# EasyEDA Pro project Nibunkatsu_One_Rev1_Project.epro, schematic Schematic1
Board Name: Board1; Create Date: 2025-12-03; Page Name: P1; Project Name: Nibunkatsu One; Schematic Name: Schematic1; Update Date: 2025-12-07; Company: GabiBrawl; Page Size: A4; Version: V1.0
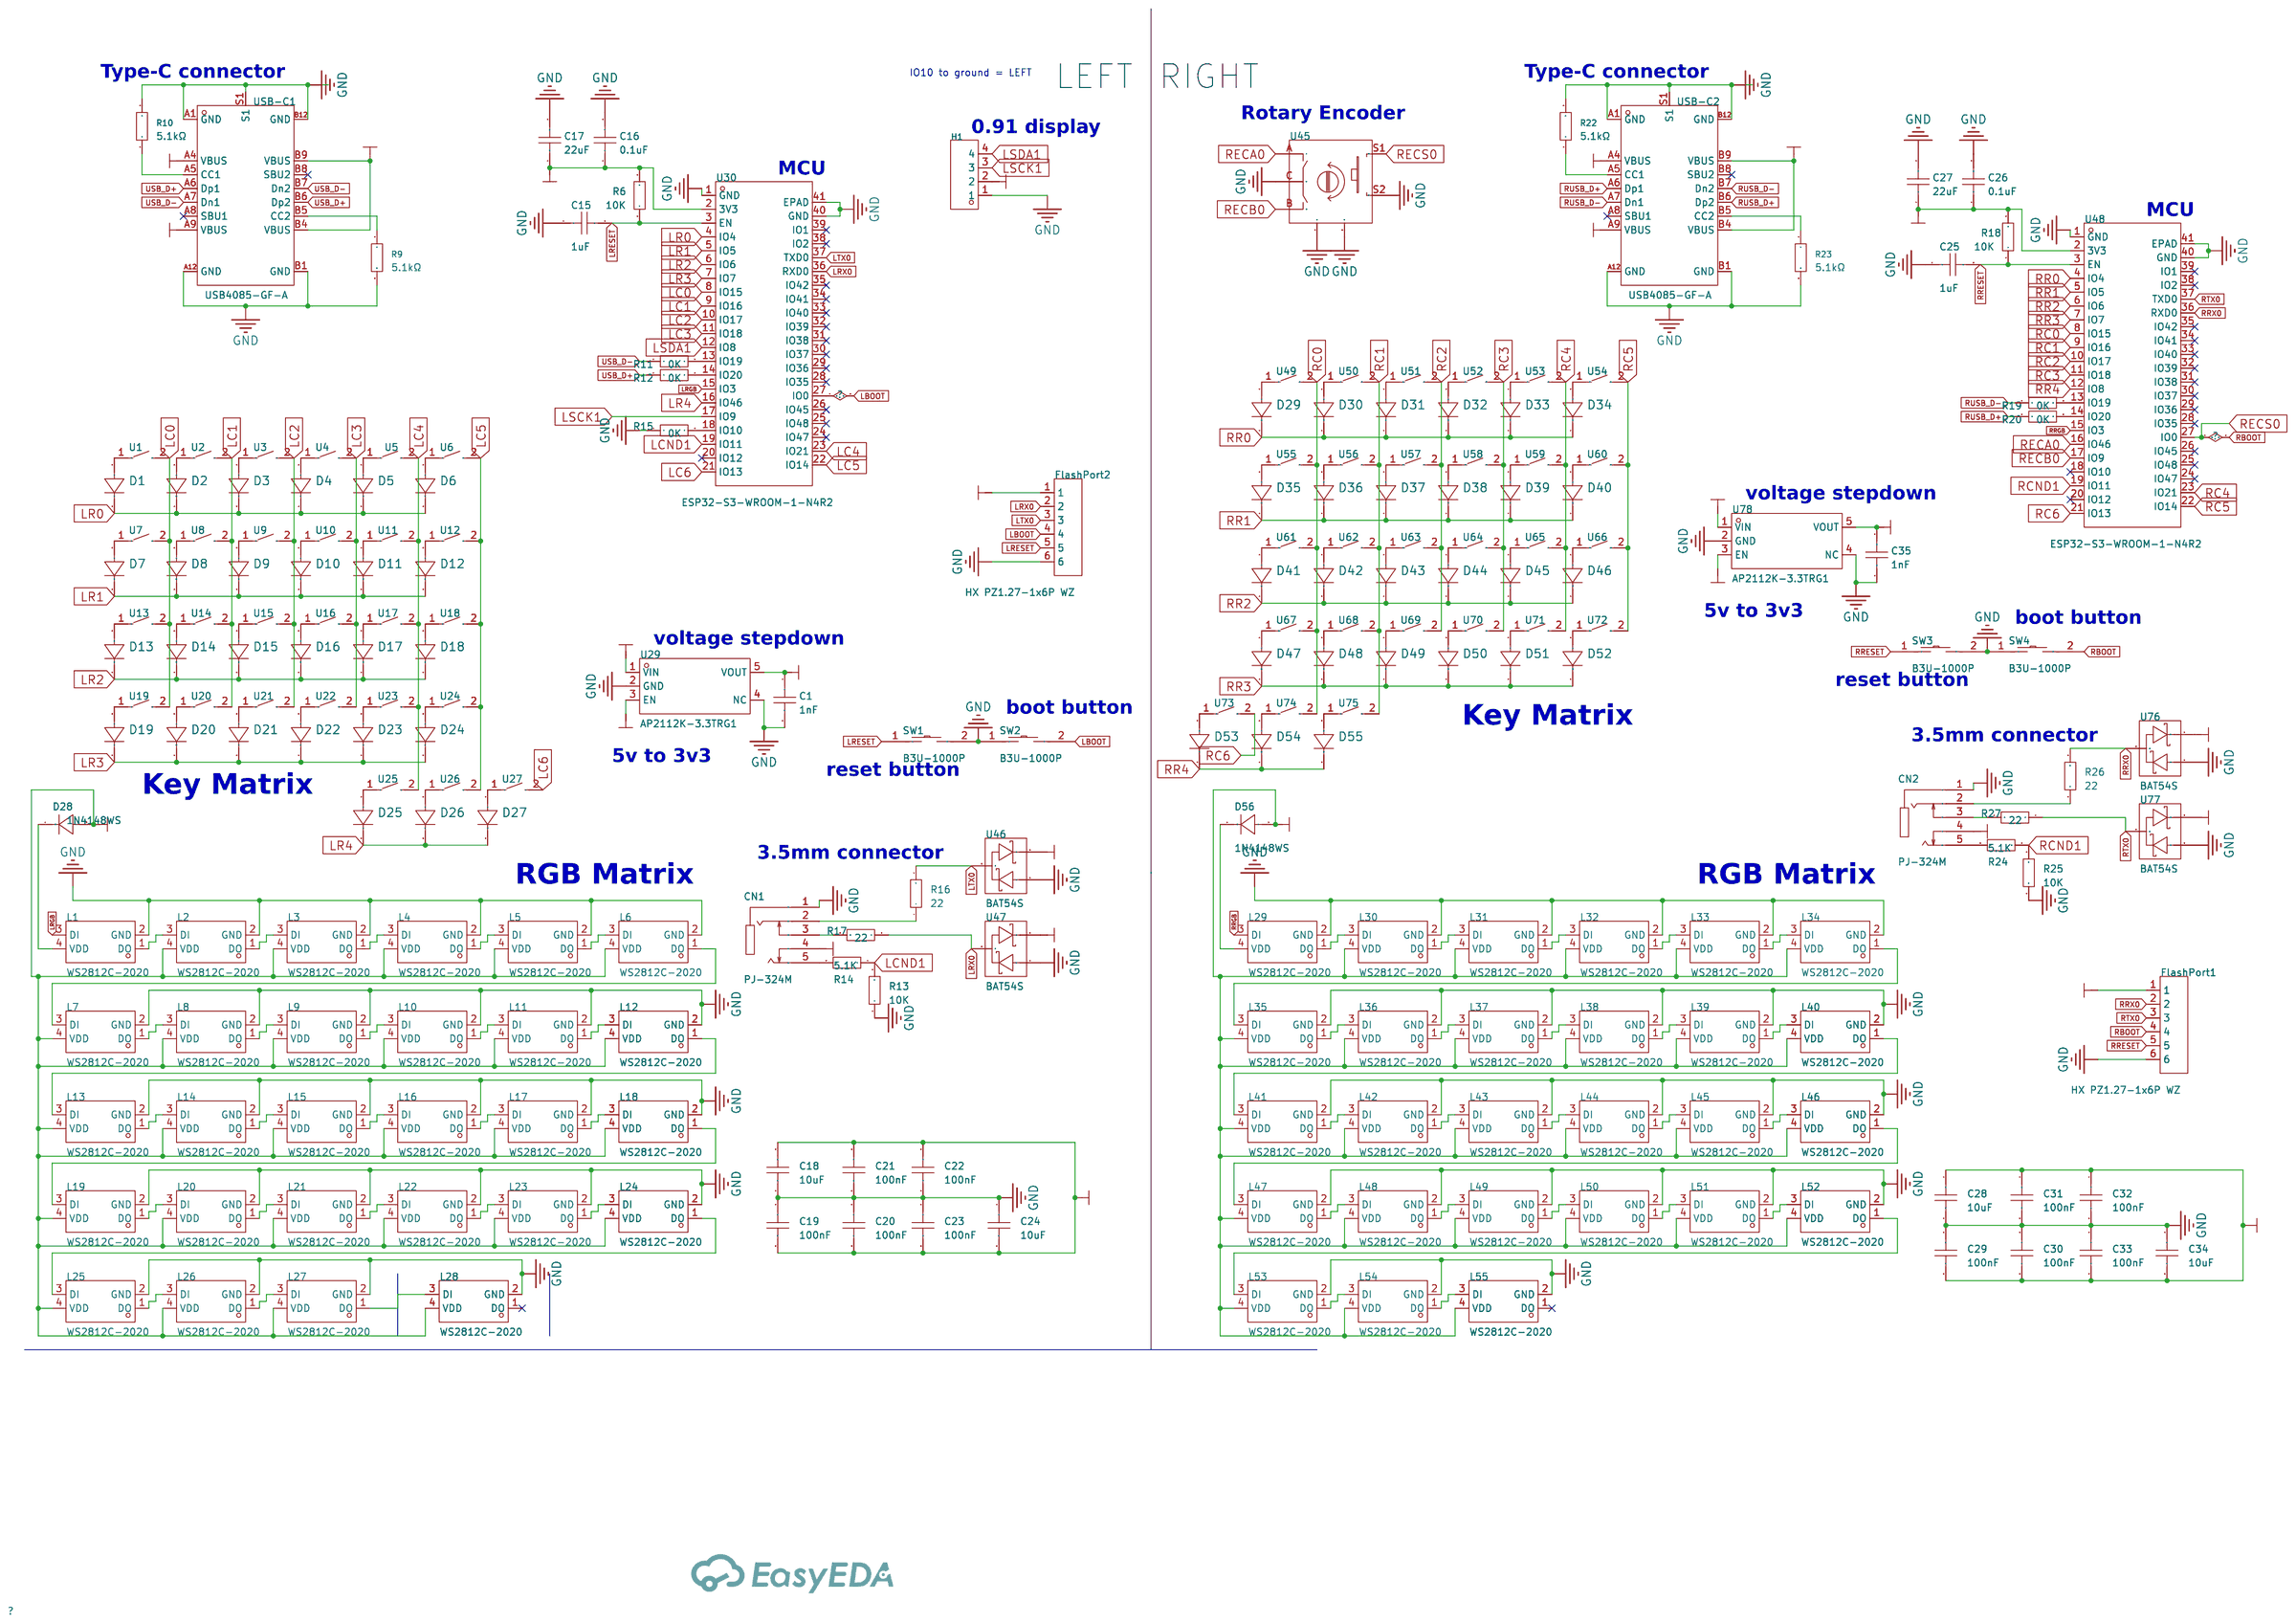
[diagram p0: schematic sheet]

## Parts
C1  1nF  [C0603]
C15  1uF  [C0603]
C16  0.1uF  [C0603]
C17  22uF  [C0603]
C18  10uF  [C0603]
C19  100nF  [C0603]
C20  100nF  [C0603]
C21  100nF  [C0603]
C22  100nF  [C0603]
C23  100nF  [C0603]
C24  10uF  [C0603]
C25  1uF  [C0603]
C26  0.1uF  [C0603]
C27  22uF  [C0603]
C28  10uF  [C0603]
C29  100nF  [C0603]
C30  100nF  [C0603]
C31  100nF  [C0603]
C32  100nF  [C0603]
C33  100nF  [C0603]
C34  10uF  [C0603]
C35  1nF  [C0603]
CN1  PJ-324M  [AUDIO-TH_PJ-324M]
CN2  PJ-324M  [AUDIO-TH_PJ-324M]
D1  1N4148WS  [SOD-323_L1.7-W1.3-LS2.7-RD]
D2  1N4148WS  [SOD-323_L1.7-W1.3-LS2.7-RD]
D3  1N4148WS  [SOD-323_L1.7-W1.3-LS2.7-RD]
D4  1N4148WS  [SOD-323_L1.7-W1.3-LS2.7-RD]
D5  1N4148WS  [SOD-323_L1.7-W1.3-LS2.7-RD]
D6  1N4148WS  [SOD-323_L1.7-W1.3-LS2.7-RD]
D7  1N4148WS  [SOD-323_L1.7-W1.3-LS2.7-RD]
D8  1N4148WS  [SOD-323_L1.7-W1.3-LS2.7-RD]
D9  1N4148WS  [SOD-323_L1.7-W1.3-LS2.7-RD]
D10  1N4148WS  [SOD-323_L1.7-W1.3-LS2.7-RD]
D11  1N4148WS  [SOD-323_L1.7-W1.3-LS2.7-RD]
D12  1N4148WS  [SOD-323_L1.7-W1.3-LS2.7-RD]
D13  1N4148WS  [SOD-323_L1.7-W1.3-LS2.7-RD]
D14  1N4148WS  [SOD-323_L1.7-W1.3-LS2.7-RD]
D15  1N4148WS  [SOD-323_L1.7-W1.3-LS2.7-RD]
D16  1N4148WS  [SOD-323_L1.7-W1.3-LS2.7-RD]
D17  1N4148WS  [SOD-323_L1.7-W1.3-LS2.7-RD]
D18  1N4148WS  [SOD-323_L1.7-W1.3-LS2.7-RD]
D19  1N4148WS  [SOD-323_L1.7-W1.3-LS2.7-RD]
D20  1N4148WS  [SOD-323_L1.7-W1.3-LS2.7-RD]
D21  1N4148WS  [SOD-323_L1.7-W1.3-LS2.7-RD]
D22  1N4148WS  [SOD-323_L1.7-W1.3-LS2.7-RD]
D23  1N4148WS  [SOD-323_L1.7-W1.3-LS2.7-RD]
D24  1N4148WS  [SOD-323_L1.7-W1.3-LS2.7-RD]
D25  1N4148WS  [SOD-323_L1.7-W1.3-LS2.7-RD]
D26  1N4148WS  [SOD-323_L1.7-W1.3-LS2.7-RD]
D27  1N4148WS  [SOD-323_L1.7-W1.3-LS2.7-RD]
D28  1N4148WS  [SOD-323_L1.7-W1.3-LS2.7-RD]
D29  1N4148WS  [SOD-323_L1.7-W1.3-LS2.7-RD]
D30  1N4148WS  [SOD-323_L1.7-W1.3-LS2.7-RD]
D31  1N4148WS  [SOD-323_L1.7-W1.3-LS2.7-RD]
D32  1N4148WS  [SOD-323_L1.7-W1.3-LS2.7-RD]
D33  1N4148WS  [SOD-323_L1.7-W1.3-LS2.7-RD]
D34  1N4148WS  [SOD-323_L1.7-W1.3-LS2.7-RD]
D35  1N4148WS  [SOD-323_L1.7-W1.3-LS2.7-RD]
D36  1N4148WS  [SOD-323_L1.7-W1.3-LS2.7-RD]
D37  1N4148WS  [SOD-323_L1.7-W1.3-LS2.7-RD]
D38  1N4148WS  [SOD-323_L1.7-W1.3-LS2.7-RD]
D39  1N4148WS  [SOD-323_L1.7-W1.3-LS2.7-RD]
D40  1N4148WS  [SOD-323_L1.7-W1.3-LS2.7-RD]
D41  1N4148WS  [SOD-323_L1.7-W1.3-LS2.7-RD]
D42  1N4148WS  [SOD-323_L1.7-W1.3-LS2.7-RD]
D43  1N4148WS  [SOD-323_L1.7-W1.3-LS2.7-RD]
D44  1N4148WS  [SOD-323_L1.7-W1.3-LS2.7-RD]
D45  1N4148WS  [SOD-323_L1.7-W1.3-LS2.7-RD]
D46  1N4148WS  [SOD-323_L1.7-W1.3-LS2.7-RD]
D47  1N4148WS  [SOD-323_L1.7-W1.3-LS2.7-RD]
D48  1N4148WS  [SOD-323_L1.7-W1.3-LS2.7-RD]
D49  1N4148WS  [SOD-323_L1.7-W1.3-LS2.7-RD]
D50  1N4148WS  [SOD-323_L1.7-W1.3-LS2.7-RD]
D51  1N4148WS  [SOD-323_L1.7-W1.3-LS2.7-RD]
D52  1N4148WS  [SOD-323_L1.7-W1.3-LS2.7-RD]
D53  1N4148WS  [SOD-323_L1.7-W1.3-LS2.7-RD]
D54  1N4148WS  [SOD-323_L1.7-W1.3-LS2.7-RD]
D55  1N4148WS  [SOD-323_L1.7-W1.3-LS2.7-RD]
D56  1N4148WS  [SOD-323_L1.7-W1.3-LS2.7-RD]
FlashPort1  HX PZ1.27-1x6P WZ  [HDR-TH_6P_HXPZ1.27-1X6PWZ]
FlashPort2  HX PZ1.27-1x6P WZ  [HDR-TH_6P_HXPZ1.27-1X6PWZ]
H1  2.54-1*4P母  [HDR-TH_4P-P2.54-V-F]
L1  WS2812C-2020  [LED-SMD_L2.2-W2.0]
L2  WS2812C-2020  [LED-SMD_L2.2-W2.0]
L3  WS2812C-2020  [LED-SMD_L2.2-W2.0]
L4  WS2812C-2020  [LED-SMD_L2.2-W2.0]
L5  WS2812C-2020  [LED-SMD_L2.2-W2.0]
L6  WS2812C-2020  [LED-SMD_L2.2-W2.0]
L7  WS2812C-2020  [LED-SMD_L2.2-W2.0]
L8  WS2812C-2020  [LED-SMD_L2.2-W2.0]
L9  WS2812C-2020  [LED-SMD_L2.2-W2.0]
L10  WS2812C-2020  [LED-SMD_L2.2-W2.0]
L11  WS2812C-2020  [LED-SMD_L2.2-W2.0]
L12  WS2812C-2020  [LED-SMD_L2.2-W2.0]
L13  WS2812C-2020  [LED-SMD_L2.2-W2.0]
L14  WS2812C-2020  [LED-SMD_L2.2-W2.0]
L15  WS2812C-2020  [LED-SMD_L2.2-W2.0]
L16  WS2812C-2020  [LED-SMD_L2.2-W2.0]
L17  WS2812C-2020  [LED-SMD_L2.2-W2.0]
L18  WS2812C-2020  [LED-SMD_L2.2-W2.0]
L19  WS2812C-2020  [LED-SMD_L2.2-W2.0]
L20  WS2812C-2020  [LED-SMD_L2.2-W2.0]
L21  WS2812C-2020  [LED-SMD_L2.2-W2.0]
L22  WS2812C-2020  [LED-SMD_L2.2-W2.0]
L23  WS2812C-2020  [LED-SMD_L2.2-W2.0]
L24  WS2812C-2020  [LED-SMD_L2.2-W2.0]
L25  WS2812C-2020  [LED-SMD_L2.2-W2.0]
L26  WS2812C-2020  [LED-SMD_L2.2-W2.0]
L27  WS2812C-2020  [LED-SMD_L2.2-W2.0]
L28  WS2812C-2020  [LED-SMD_L2.2-W2.0]
L29  WS2812C-2020  [LED-SMD_L2.2-W2.0]
L30  WS2812C-2020  [LED-SMD_L2.2-W2.0]
L31  WS2812C-2020  [LED-SMD_L2.2-W2.0]
L32  WS2812C-2020  [LED-SMD_L2.2-W2.0]
L33  WS2812C-2020  [LED-SMD_L2.2-W2.0]
L34  WS2812C-2020  [LED-SMD_L2.2-W2.0]
L35  WS2812C-2020  [LED-SMD_L2.2-W2.0]
L36  WS2812C-2020  [LED-SMD_L2.2-W2.0]
L37  WS2812C-2020  [LED-SMD_L2.2-W2.0]
L38  WS2812C-2020  [LED-SMD_L2.2-W2.0]
L39  WS2812C-2020  [LED-SMD_L2.2-W2.0]
L40  WS2812C-2020  [LED-SMD_L2.2-W2.0]
L41  WS2812C-2020  [LED-SMD_L2.2-W2.0]
L42  WS2812C-2020  [LED-SMD_L2.2-W2.0]
L43  WS2812C-2020  [LED-SMD_L2.2-W2.0]
L44  WS2812C-2020  [LED-SMD_L2.2-W2.0]
L45  WS2812C-2020  [LED-SMD_L2.2-W2.0]
L46  WS2812C-2020  [LED-SMD_L2.2-W2.0]
L47  WS2812C-2020  [LED-SMD_L2.2-W2.0]
L48  WS2812C-2020  [LED-SMD_L2.2-W2.0]
L49  WS2812C-2020  [LED-SMD_L2.2-W2.0]
L50  WS2812C-2020  [LED-SMD_L2.2-W2.0]
L51  WS2812C-2020  [LED-SMD_L2.2-W2.0]
L52  WS2812C-2020  [LED-SMD_L2.2-W2.0]
L53  WS2812C-2020  [LED-SMD_L2.2-W2.0]
L54  WS2812C-2020  [LED-SMD_L2.2-W2.0]
L55  WS2812C-2020  [LED-SMD_L2.2-W2.0]
R6  10K  [R0603]
R9  5.1kΩ  [R0805]
R10  5.1kΩ  [R0805]
R11  0K  [R0603]
R12  0K  [R0603]
R13  10K  [R0603]
R14  5.1K  [R0603]
R15  0K  [R0603]
R16  22  [R0603]
R17  22  [R0603]
R18  10K  [R0603]
R19  0K  [R0603]
R20  0K  [R0603]
R22  5.1kΩ  [R0805]
R23  5.1kΩ  [R0805]
R24  5.1K  [R0603]
R25  10K  [R0603]
R26  22  [R0603]
R27  22  [R0603]
SW1  B3U-1000P  [KEY-SMD_B3U-1000PM]
SW2  B3U-1000P  [KEY-SMD_B3U-1000PM]
SW3  B3U-1000P  [KEY-SMD_B3U-1000PM]
SW4  B3U-1000P  [KEY-SMD_B3U-1000PM]
U1  -  [SW_Gateron_LowProfile_HotSwap_PTH1]
U2  -  [SW_Gateron_LowProfile_HotSwap_PTH1]
U3  -  [SW_Gateron_LowProfile_HotSwap_PTH1]
U4  -  [SW_Gateron_LowProfile_HotSwap_PTH1]
U5  -  [SW_Gateron_LowProfile_HotSwap_PTH1]
U6  -  [SW_Gateron_LowProfile_HotSwap_PTH1]
U7  -  [SW_Gateron_LowProfile_HotSwap_PTH1]
U8  -  [SW_Gateron_LowProfile_HotSwap_PTH1]
U9  -  [SW_Gateron_LowProfile_HotSwap_PTH1]
U10  -  [SW_Gateron_LowProfile_HotSwap_PTH1]
U11  -  [SW_Gateron_LowProfile_HotSwap_PTH1]
U12  -  [SW_Gateron_LowProfile_HotSwap_PTH1]
U13  -  [SW_Gateron_LowProfile_HotSwap_PTH1]
U14  -  [SW_Gateron_LowProfile_HotSwap_PTH1]
U15  -  [SW_Gateron_LowProfile_HotSwap_PTH1]
U16  -  [SW_Gateron_LowProfile_HotSwap_PTH1]
U17  -  [SW_Gateron_LowProfile_HotSwap_PTH1]
U18  -  [SW_Gateron_LowProfile_HotSwap_PTH1]
U19  -  [SW_Gateron_LowProfile_HotSwap_PTH1]
U20  -  [SW_Gateron_LowProfile_HotSwap_PTH1]
U21  -  [SW_Gateron_LowProfile_HotSwap_PTH1]
U22  -  [SW_Gateron_LowProfile_HotSwap_PTH1]
U23  -  [SW_Gateron_LowProfile_HotSwap_PTH1]
U24  -  [SW_Gateron_LowProfile_HotSwap_PTH1]
U25  -  [SW_Gateron_LowProfile_HotSwap_PTH1]
U26  -  [SW_Gateron_LowProfile_HotSwap_PTH1]
U27  -  [SW_Gateron_LowProfile_HotSwap_PTH1]
U29  AP2112K-3.3TRG1  [SOT-25-5_L2.9-W1.6-P0.95-LS2.8-BL]
U30  ESP32-S3-WROOM-1-N4R2  [WIRELM-SMD_ESP32-S3-WROOM-1]
U45  -  [RotaryEncoder_Alps_EC11E-Switch_Vertical_H20mm]
U46  BAT54S  [SOT-23-3_L2.9-W1.3-P1.90-LS2.4-BR]
U47  BAT54S  [SOT-23-3_L2.9-W1.3-P1.90-LS2.4-BR]
U48  ESP32-S3-WROOM-1-N4R2  [WIRELM-SMD_ESP32-S3-WROOM-1]
U49  -  [SW_Gateron_LowProfile_HotSwap_PTH1]
U50  -  [SW_Gateron_LowProfile_HotSwap_PTH1]
U51  -  [SW_Gateron_LowProfile_HotSwap_PTH1]
U52  -  [SW_Gateron_LowProfile_HotSwap_PTH1]
U53  -  [SW_Gateron_LowProfile_HotSwap_PTH1]
U54  -  [SW_Gateron_LowProfile_HotSwap_PTH1]
U55  -  [SW_Gateron_LowProfile_HotSwap_PTH1]
U56  -  [SW_Gateron_LowProfile_HotSwap_PTH1]
U57  -  [SW_Gateron_LowProfile_HotSwap_PTH1]
U58  -  [SW_Gateron_LowProfile_HotSwap_PTH1]
U59  -  [SW_Gateron_LowProfile_HotSwap_PTH1]
U60  -  [SW_Gateron_LowProfile_HotSwap_PTH1]
U61  -  [SW_Gateron_LowProfile_HotSwap_PTH1]
U62  -  [SW_Gateron_LowProfile_HotSwap_PTH1]
U63  -  [SW_Gateron_LowProfile_HotSwap_PTH1]
U64  -  [SW_Gateron_LowProfile_HotSwap_PTH1]
U65  -  [SW_Gateron_LowProfile_HotSwap_PTH1]
U66  -  [SW_Gateron_LowProfile_HotSwap_PTH1]
U67  -  [SW_Gateron_LowProfile_HotSwap_PTH1]
U68  -  [SW_Gateron_LowProfile_HotSwap_PTH1]
U69  -  [SW_Gateron_LowProfile_HotSwap_PTH1]
U70  -  [SW_Gateron_LowProfile_HotSwap_PTH1]
U71  -  [SW_Gateron_LowProfile_HotSwap_PTH1]
U72  -  [SW_Gateron_LowProfile_HotSwap_PTH1]
U73  -  [SW_Gateron_LowProfile_HotSwap_PTH1]
U74  -  [SW_Gateron_LowProfile_HotSwap_PTH1]
U75  -  [SW_Gateron_LowProfile_HotSwap_PTH1]
U76  BAT54S  [SOT-23-3_L2.9-W1.3-P1.90-LS2.4-BR]
U77  BAT54S  [SOT-23-3_L2.9-W1.3-P1.90-LS2.4-BR]
U78  AP2112K-3.3TRG1  [SOT-25-5_L2.9-W1.6-P0.95-LS2.8-BL]
USB-C1  USB4085-GF-A  [USC-C-SMD_USB4085-GF-A]
USB-C2  USB4085-GF-A  [USC-C-SMD_USB4085-GF-A]

## Library data of the parts
C1 C15-C35 = CAP_0603: Supplier Footprint: 0603
CN1 CN2 = PJ-324M: Connector Type:3.5mm Headphone Jack Current Rating:50mA Voltage Rating (Max):24V Contact Material:Phosphor Bronze Contact Plating:- Operating Temperature:-25℃~+75℃ Operating Temperature:-25℃~+75℃; LCSC Part Name: 2件套 3.5mm耳机座; Supplier Part: C22355739; Manufacturer: SOFNG(硕方); Supplier Footprint: 插件; JLCPCB Part Class: Extended Part; Datasheet: https://item.szlcsc.com/datasheet/PJ-324M/23787620.html; Supplier: LCSC; Connector Type: 3.5mm Headphone Jack; Current Rating: 50mA; Voltage Rating (Max): 24V; Contact Material: Phosphor Bronze; Operating Temperature: -25℃~+75℃
D1-D27 D29-D55 = 1N4148WS_C5381436: Voltage - DC Reverse(Vr):75V Current - Rectified:200mA; Supplier Part: C5381436; Manufacturer: FOSAN(富捷/富信); Supplier Footprint: SOD-323; JLCPCB Part Class: Extended Part; Datasheet: https://atta.szlcsc.com/upload/public/pdf/source/20230330/BED04A7599B1CD0FB6785C43972F2AE7.pdf; Supplier: LCSC; Voltage - DC Reverse(Vr): 75V; Current - Rectified: 200mA
D28 D56 = 1N4148WS_1: Supplier Part: C51898295; Manufacturer: baocheng(宝乘); Supplier Footprint: SOD-323; JLCPCB Part Class: Extended Part; Datasheet: https://item.szlcsc.com/datasheet/1N4148WS/54583720.html; Supplier: LCSC
FlashPort1 FlashPort2 = HX PZ1.27-1x6P FlashPort: LCSC Part Name: 1x6P 间距:1.27mm 方针 弯插; Supplier Part: C22438192; Manufacturer: hanxia(韩下); Supplier Footprint: 弯插,P=1.27mm; JLCPCB Part Class: Extended Part; Datasheet: https://atta.szlcsc.com/upload/public/pdf/source/20240522/2A3BF42C6652507E0B5C8538331602D0.pdf; Supplier: LCSC; Pin Structure: 1x6P; Pitch: 1.27mm; Circluar Pins/Square Pins: Policy; Mounting Type: Right-Angle; Number of Rows: Single Row; Number of Pins: 6P; Current Rating: 1A; Length of Mating Pin: 4mm; Insulation Height: 1mm; Length of End Connection Pin: 2.6mm; Contact Material: Phosphor Bronze; Contact Plating: Gold; Operating Temperature: -40℃~+105℃; Color: Black
H1 = 0.91 display oled: Supplier: LCSC; Supplier Part: C2718488; Manufacturer: BOOMELE(博穆精密); JLCPCB Part Class: Extended Part; LCSC Part Name: 间距:2.54mm 1x4P 直插; Supplier Footprint: 插件,P=2.54mm; Datasheet: https://item.szlcsc.com/datasheet/2.54-1*4P%25E6%25AF%258D/2834502.html; Holes Structure: 1x4P; Pitch: 2.54mm; Circular Hole / Square Hole: Square Hole; Mounting Type: Through Hole; Number of Rows: 1; Number of Positions: 4P; Current Rating: 3A; Holes Direction: Top; Contact Material: Bronze; Operating Temperature: -40℃~+105℃
L1-L55 = WS2812C-2020: Wavelength:460nm；520nm；623nm Operating Temperature:-25℃~+85℃; Supplier Part: C965556; Manufacturer: worldsemi; Supplier Footprint: SMD,2x2mm; Datasheet: https://atta.szlcsc.com/upload/public/pdf/source/20201203/C965556_B52DCEA0E250ABD59F33ED24C4AD3075.pdf; Supplier: LCSC; Wavelength: 460nm；520nm；623nm; Operating Temperature: -25℃~+85℃
R6 R11-R20 R24-R27 = Res_0603: Supplier Footprint: 0603
R9 R10 R22 R23 = RMC08055.1K1%N: Type:Thick Film Resistor Resistance:5.1kΩ Tolerance:±1% Tolerance:±1% Power(Watts):125mW Voltage-Supply(Max):150V Temperature Coefficient:±100ppm/℃ Temperature Coefficient:±100ppm/℃ Operating Temperature:-55℃~+155℃ Operating Temperature:-55℃~+155℃; LCSC Part Name: 5.1kΩ ±1% 125mW; Supplier Part: C269748; Manufacturer: Tyohm(幸亚电阻); Supplier Footprint: 0805; JLCPCB Part Class: Extended Part; Datasheet: https://item.szlcsc.com/datasheet/RMC08055.1K1%2525N/259188.html; Supplier: LCSC; Type: Thick Film Resistor; Tolerance: ±1%; Power(Watts): 125mW; Voltage-Supply(Max): 150V; Temperature Coefficient: ±100ppm/℃; Operating Temperature: -55℃~+155℃
SW1-SW4 = B3U-1000P_C231329: Circuit:SPST Actuator Style:Round Button Operating Force:1.53N Mounting Type:Surface Mount,Vertical Length:3mm Width:2.5mm Switch Height:1.6mm Contact Current:50mA Voltage Rating:12V With Lamp:- Termination Style:SMD(SMT) Tab Life:- Operating Temperature:; LCSC Part Name: 3*2.5*1.6mm 立贴 轻触开关; Supplier Part: C231329; Manufacturer: OMRON(欧姆龙); Supplier Footprint: SMD,2.5x3mm; JLCPCB Part Class: Extended Part; Datasheet: https://item.szlcsc.com/datasheet/B3U-1000P/231216.html; Supplier: LCSC; Circuit: SPST; Actuator Style: Round Button; Operating Force: 1.53N; Mounting Type: Surface Mount,Vertical; Length: 3mm; Width: 2.5mm; Switch Height: 1.6mm; Contact Current: 50mA; Voltage Rating: 12V; Termination Style: SMD(SMT) Tab; Operating Temperature: -25℃~+70℃
U1-U27 U49-U75 = SW_Gateron_LowProfile_HotSwap_PTH1
U29 U78 = AP2112K-3.3TRG1: Output Type:Fixed Maximum Input Voltage:6V Output Voltage:3.3V Output Voltage:3.3V Output Current:600mA Power Supply Rejection Ratio (PSRR):65dB@(1kHz) Dropout Voltage:400mV@(600mA) standby current:80uA Feature:ESD Protection；Automatic Discharge Function；; LCSC Part Name: 输入6V 输出3.3V 600mA; Supplier Part: C51118; Manufacturer: DIODES(美台); Supplier Footprint: SOT-25-5; JLCPCB Part Class: Extended Part; Datasheet: https://atta.szlcsc.com/upload/public/pdf/source/20171221/C51118_15138312998391195590.pdf; Supplier: LCSC; Output Type: Fixed; Maximum Input Voltage: 6V; Output Voltage: 3.3V; Output Current: 600mA; Power Supply Rejection Ratio (PSRR): 65dB@(1kHz); Dropout Voltage: 400mV@(600mA); standby current: 80uA; Feature: ESD Protection；Automatic Discharge Function；Low ESR；Thermal Protection(TSD)；Overcurrent Protection(OCP)；With ability; Operating Temperature: -40℃~+85℃; Output Polarity: Positive electrode; Number of Outputs: 1
U30 U48 = ESP32-S3-WROOM-1-N4R2: LCSC Part Name: 通用型Wi-Fi+低功耗蓝牙MCU模组; Supplier Part: C2913203; Manufacturer: ESPRESSIF(乐鑫); Supplier Footprint: SMD,18x25.5mm; JLCPCB Part Class: Extended Part; Datasheet: https://atta.szlcsc.com/upload/public/pdf/source/20241030/6A412B13087E1327DF6279F5735253CA.pdf; Supplier: LCSC
U45 = PEC11
U46 U47 U76 U77 = BAT54S_C22374724: Voltage - Forward(Vf@If):1V@100mA Voltage - DC Reverse(Vr):30V Current - Rectified:200mA Reverse Leakage Current (Ir):2uA@25V Non-Repetitive Peak Forward Surge Current:600mA; LCSC Part Name: 电压:30V 电流:200mA; Supplier Part: C22374724; Manufacturer: DOWO(东沃); Supplier Footprint: SOT-23; JLCPCB Part Class: Extended Part; Datasheet: https://item.szlcsc.com/datasheet/BAT54S/23877862.html; Supplier: LCSC; Voltage - Forward(Vf@If): 1V@100mA; Voltage - DC Reverse(Vr): 30V; Current - Rectified: 200mA; Reverse Leakage Current (Ir): 2uA@25V; Non-Repetitive Peak Forward Surge Current: 600mA
USB-C1 USB-C2 = USB4085-GF-A_C7095263: Supplier Part: C7095263; Manufacturer: GCT; Supplier Footprint: 插件; JLCPCB Part Class: Extended Part; Datasheet: https://atta.szlcsc.com/upload/public/pdf/source/20240130/13BD148244FAEE722A2AF59585DC5F07.pdf; Supplier: LCSC

## Nets
+3.3V: C1.1 C16.1 C17.1 FlashPort2.1 H1.2 R6.2 U29.5(VOUT) U30.2(3V3) U46.2 U47.2
+3.3V_R: C26.1 C27.1 C35.1 FlashPort1.1 R18.2 U48.2(3V3) U76.2 U77.2 U78.5(VOUT)
GND: C1.2 C15.1 C16.2 C17.2 C18.2 C19.1 C20.1 C21.2 C22.2 C23.1 C24.1 C25.1 C26.2 C27.2 C28.2 C29.1 C30.1 C31.2 C32.2 C33.1 C34.1 C35.2 CN1.1 CN2.1 FlashPort1.6 FlashPort2.6 H1.1 L1.2(GND) L2.2(GND) L3.2(GND) L4.2(GND) L5.2(GND) L6.2(GND) L7.2(GND) L8.2(GND) L9.2(GND) L10.2(GND) L11.2(GND) L12.2(GND) L13.2(GND) L14.2(GND) L15.2(GND) L16.2(GND) L17.2(GND) L18.2(GND) L19.2(GND) L20.2(GND) L21.2(GND) L22.2(GND) L23.2(GND) L24.2(GND) L25.2(GND) L26.2(GND) L27.2(GND) L28.2(GND) L29.2(GND) L30.2(GND) L31.2(GND) L32.2(GND) L33.2(GND) L34.2(GND) L35.2(GND) L36.2(GND) L37.2(GND) L38.2(GND) L39.2(GND) L40.2(GND) L41.2(GND) L42.2(GND) L43.2(GND) L44.2(GND) L45.2(GND) L46.2(GND) L47.2(GND) L48.2(GND) L49.2(GND) L50.2(GND) L51.2(GND) L52.2(GND) L53.2(GND) L54.2(GND) L55.2(GND) R9.2 R10.2 R13.1 R15.1 R22.2 R23.2 R25.1 SW1.2 SW2.1 SW3.2 SW4.1 U29.2(GND) U29.4(NC) U30.1(GND) U30.40(GND) U30.41(EPAD) U45.C U45.MT1(MP) U45.MT2(MP) U45.S2(2) U46.1 U47.1 U48.1(GND) U48.40(GND) U48.41(EPAD) U76.1 U77.1 U78.2(GND) U78.4(NC) USB-C1.A1(GND) USB-C1.A12(GND) USB-C1.B1(GND) USB-C1.B12(GND) USB-C1.S1 USB-C2.A1(GND) USB-C2.A12(GND) USB-C2.B1(GND) USB-C2.B12(GND) USB-C2.S1
VBUS: C18.1 C19.2 C20.2 C21.1 C22.1 C23.2 C24.2 CN1.4 D28.2(A) L2.4(VDD) L3.4(VDD) L4.4(VDD) L5.4(VDD) L6.4(VDD) L7.4(VDD) L8.4(VDD) L9.4(VDD) L10.4(VDD) L11.4(VDD) L12.4(VDD) L13.4(VDD) L14.4(VDD) L15.4(VDD) L16.4(VDD) L17.4(VDD) L18.4(VDD) L19.4(VDD) L20.4(VDD) L21.4(VDD) L22.4(VDD) L23.4(VDD) L24.4(VDD) L25.4(VDD) L26.4(VDD) L27.4(VDD) L28.4(VDD) U29.1(VIN) U29.3(EN) USB-C1.A4(VBUS) USB-C1.A9(VBUS) USB-C1.B4(VBUS) USB-C1.B9(VBUS)
VBUS_R: C28.1 C29.2 C30.2 C31.1 C32.1 C33.2 C34.2 CN2.4 D56.2(A) L30.4(VDD) L31.4(VDD) L32.4(VDD) L33.4(VDD) L34.4(VDD) L35.4(VDD) L36.4(VDD) L37.4(VDD) L38.4(VDD) L39.4(VDD) L40.4(VDD) L41.4(VDD) L42.4(VDD) L43.4(VDD) L44.4(VDD) L45.4(VDD) L46.4(VDD) L47.4(VDD) L48.4(VDD) L49.4(VDD) L50.4(VDD) L51.4(VDD) L52.4(VDD) L53.4(VDD) L54.4(VDD) L55.4(VDD) U78.1(VIN) U78.3(EN) USB-C2.A4(VBUS) USB-C2.A9(VBUS) USB-C2.B4(VBUS) USB-C2.B9(VBUS)
LBOOT: FlashPort2.4 SW2.2 U30.27(IO0)
LC0: U1.2 U7.2 U13.2 U19.2 U30.8(IO15)
LC1: U2.2 U8.2 U14.2 U20.2 U30.9(IO16)
LC2: U3.2 U9.2 U15.2 U21.2 U30.10(IO17)
LC3: U4.2 U10.2 U16.2 U22.2 U30.11(IO18)
LC4: U5.2 U11.2 U17.2 U23.2 U25.2 U30.23(IO21)
LC5: U6.2 U12.2 U18.2 U24.2 U26.2 U30.22(IO14)
LC6: U27.2 U30.21(IO13)
LCND1: R13.2 R14.1 U30.19(IO11)
LR0: D1.1(C) D2.1(C) D3.1(C) D4.1(C) D5.1(C) D6.1(C) U30.4(IO4)
LR1: D7.1(C) D8.1(C) D9.1(C) D10.1(C) D11.1(C) D12.1(C) U30.5(IO5)
LR2: D13.1(C) D14.1(C) D15.1(C) D16.1(C) D17.1(C) D18.1(C) U30.6(IO6)
LR3: D19.1(C) D20.1(C) D21.1(C) D22.1(C) D23.1(C) D24.1(C) U30.7(IO7)
LR4: D25.1(C) D26.1(C) D27.1(C) U30.16(IO46)
LRESET: C15.2 FlashPort2.5 R6.1 SW1.1 U30.3(EN)
LRGB: L1.3(DI) U30.15(IO3)
LRX0: FlashPort2.2 R17.1 U30.36(RXD0) U47.3
LSCK1: H1.3 U30.17(IO9)
LSDA1: H1.4 U30.12(IO8)
LTX0: FlashPort2.3 R16.2 U30.37(TXD0) U46.3
RBOOT: FlashPort1.4 SW4.2 U45.S1(1) U48.27(IO0)
RC0: U48.8(IO15) U49.2 U55.2 U61.2 U67.2 U74.2
RC1: U48.9(IO16) U50.2 U56.2 U62.2 U68.2 U75.2
RC2: U48.10(IO17) U51.2 U57.2 U63.2 U69.2
RC3: U48.11(IO18) U52.2 U58.2 U64.2 U70.2
RC4: U48.23(IO21) U53.2 U59.2 U65.2 U71.2
RC5: U48.22(IO14) U54.2 U60.2 U66.2 U72.2
RC6: U48.21(IO13) U73.2
RCND1: R24.1 R25.2 U48.19(IO11)
RECA0: U45.A U48.16(IO46)
RECB0: U45.B U48.17(IO9)
RR0: D29.1(C) D30.1(C) D31.1(C) D32.1(C) D33.1(C) D34.1(C) U48.4(IO4)
RR1: D35.1(C) D36.1(C) D37.1(C) D38.1(C) D39.1(C) D40.1(C) U48.5(IO5)
RR2: D41.1(C) D42.1(C) D43.1(C) D44.1(C) D45.1(C) D46.1(C) U48.6(IO6)
RR3: D47.1(C) D48.1(C) D49.1(C) D50.1(C) D51.1(C) D52.1(C) U48.7(IO7)
RR4: D53.1(C) D54.1(C) D55.1(C) U48.12(IO8)
RRESET: C25.2 FlashPort1.5 R18.1 SW3.1 U48.3(EN)
RRGB: L29.3(DI) U48.15(IO3)
RRX0: FlashPort1.2 R26.2 U48.36(RXD0) U76.3
RTX0: FlashPort1.3 R27.1 U48.37(TXD0) U77.3
RUSB_D+: R20.1 USB-C2.A6(Dp1) USB-C2.B6(Dp2)
RUSB_D-: R19.1 USB-C2.A7(Dn1) USB-C2.B7(Dn2)
USB_D+: R12.1 USB-C1.A6(Dp1) USB-C1.B6(Dp2)
USB_D-: R11.1 USB-C1.A7(Dn1) USB-C1.B7(Dn2)
$1N859: R10.1 USB-C1.A5(CC1)
$1N4283: L1.1(DO) L2.3(DI)
$1N4290: L2.1(DO) L3.3(DI)
$1N4298: L3.1(DO) L4.3(DI)
$1N4425: L4.1(DO) L5.3(DI)
$1N4432: L5.1(DO) L6.3(DI)
$1N4762: L11.1(DO) L12.3(DI)
$1N4767: L10.1(DO) L11.3(DI)
$1N4772: L9.1(DO) L10.3(DI)
$1N4777: L8.1(DO) L9.3(DI)
$1N4782: L7.1(DO) L8.3(DI)
$1N5063: L13.1(DO) L14.3(DI)
$1N5068: L14.1(DO) L15.3(DI)
$1N5073: L15.1(DO) L16.3(DI)
$1N5078: L16.1(DO) L17.3(DI)
$1N5083: L17.1(DO) L18.3(DI)
$1N5340: L19.1(DO) L20.3(DI)
$1N5345: L20.1(DO) L21.3(DI)
$1N5350: L21.1(DO) L22.3(DI)
$1N5355: L22.1(DO) L23.3(DI)
$1N5360: L23.1(DO) L24.3(DI)
$1N5367: L6.1(DO) L7.3(DI)
$1N5374: L12.1(DO) L13.3(DI)
$1N5382: L18.1(DO) L19.3(DI)
$1N5563: L25.1(DO) L26.3(DI)
$1N5573: L26.1(DO) L27.3(DI)
$1N5638: L24.1(DO) L25.3(DI)
$1N5802: R9.1 USB-C1.B5(CC2)
$1N10892: L27.1(DO) L28.3(DI)
$1N11219: R11.2 U30.13(IO19)
$1N11224: R12.2 U30.14(IO20)
$1N11282: CN1.3 R17.2
$1N11452: CN1.5 R14.2
$1N11590: R15.2 U30.18(IO10)
$1N20463: D1.2(A) U1.1
$1N20497: D2.2(A) U2.1
$1N20531: D3.2(A) U3.1
$1N20565: D4.2(A) U4.1
$1N20599: D5.2(A) U5.1
$1N20633: D6.2(A) U6.1
$1N20671: D7.2(A) U7.1
$1N20705: D8.2(A) U8.1
$1N20739: D9.2(A) U9.1
$1N20773: D10.2(A) U10.1
$1N20807: D11.2(A) U11.1
$1N20841: D12.2(A) U12.1
$1N20879: D13.2(A) U13.1
$1N20913: D14.2(A) U14.1
$1N20948: D15.2(A) U15.1
$1N20983: D16.2(A) U16.1
$1N21018: D17.2(A) U17.1
$1N21053: D18.2(A) U18.1
$1N21087: D19.2(A) U19.1
$1N21154: D21.2(A) U21.1
$1N21189: D22.2(A) U22.1
$1N21224: D23.2(A) U23.1
$1N21259: D24.2(A) U24.1
$1N21293: D25.2(A) U25.1
$1N21327: D26.2(A) U26.1
$1N21362: D27.2(A) U27.1
$1N21868: D28.1(C) L1.4(VDD)
$1N26989: D20.2(A) U20.1
$1N27480: CN1.2 R16.1
$1N30675: R20.2 U48.14(IO20)
$1N30676: R19.2 U48.13(IO19)
$1N33638: L29.1(DO) L30.3(DI)
$1N33639: L30.1(DO) L31.3(DI)
$1N33640: L31.1(DO) L32.3(DI)
$1N33641: L32.1(DO) L33.3(DI)
$1N33642: L33.1(DO) L34.3(DI)
$1N33644: L35.1(DO) L36.3(DI)
$1N33645: L36.1(DO) L37.3(DI)
$1N33646: L37.1(DO) L38.3(DI)
$1N33647: L38.1(DO) L39.3(DI)
$1N33648: L39.1(DO) L40.3(DI)
$1N33650: L41.1(DO) L42.3(DI)
$1N33651: L42.1(DO) L43.3(DI)
$1N33652: L43.1(DO) L44.3(DI)
$1N33653: L44.1(DO) L45.3(DI)
$1N33654: L45.1(DO) L46.3(DI)
$1N33656: L47.1(DO) L48.3(DI)
$1N33657: L48.1(DO) L49.3(DI)
$1N33658: L49.1(DO) L50.3(DI)
$1N33659: L50.1(DO) L51.3(DI)
$1N33660: L51.1(DO) L52.3(DI)
$1N33661: L34.1(DO) L35.3(DI)
$1N33662: L40.1(DO) L41.3(DI)
$1N33663: L46.1(DO) L47.3(DI)
$1N33665: L53.1(DO) L54.3(DI)
$1N33666: L54.1(DO) L55.3(DI)
$1N33667: L52.1(DO) L53.3(DI)
$1N33678: D29.2(A) U49.1
$1N33679: D30.2(A) U50.1
$1N33680: D31.2(A) U51.1
$1N33681: D32.2(A) U52.1
$1N33682: D33.2(A) U53.1
$1N33683: D34.2(A) U54.1
$1N33684: D35.2(A) U55.1
$1N33685: D36.2(A) U56.1
$1N33686: D37.2(A) U57.1
$1N33687: D38.2(A) U58.1
$1N33688: D39.2(A) U59.1
$1N33689: D40.2(A) U60.1
$1N33690: D41.2(A) U61.1
$1N33691: D42.2(A) U62.1
$1N33692: D43.2(A) U63.1
$1N33693: D44.2(A) U64.1
$1N33694: D45.2(A) U65.1
$1N33695: D46.2(A) U66.1
$1N33696: D47.2(A) U67.1
$1N33697: D49.2(A) U69.1
$1N33698: D50.2(A) U70.1
$1N33699: D51.2(A) U71.1
$1N33700: D52.2(A) U72.1
$1N33707: D56.1(C) L29.4(VDD)
$1N33709: D48.2(A) U68.1
$1N33990: R22.1 USB-C2.A5(CC1)
$1N33999: R23.1 USB-C2.B5(CC2)
$1N34695: CN2.2 R26.1
$1N34700: CN2.3 R27.2
$1N34702: CN2.5 R24.2
$1N42738: D54.2(A) U74.1
$1N42739: D55.2(A) U75.1
$1N42741: D53.2(A) U73.1

Not connected (* = marked no-connect by the designer): L28 1(DO)*; L55 1(DO)*; U30 20(IO12)* 24(IO47)* 25(IO48)* 26(IO45)* 28(IO35)* 29(IO36)* 30(IO37)* 31(IO38)* 32(IO39)* 33(IO40)* 34(IO41)* 35(IO42)* 38(IO2)* 39(IO1)*; U48 18(IO10)* 20(IO12)* 24(IO47)* 25(IO48)* 26(IO45)* 28(IO35)* 29(IO36)* 30(IO37)* 31(IO38)* 32(IO39)* 33(IO40)* 34(IO41)* 35(IO42)* 38(IO2)* 39(IO1)*; USB-C1 A8(SBU1)* B8(SBU2)*; USB-C2 A8(SBU1)* B8(SBU2)*

## Notes on the sheet
- IO10 to ground = LEFT
- Type-C connector
- LEFT
- RIGHT
- Type-C connector
- Rotary Encoder
- 0.91 display
- MCU
- MCU
- voltage stepdown
- 5v to 3v3
- boot button
- voltage stepdown
- reset button
- boot button
- Key Matrix
- 3.5mm connector
- 5v to 3v3
- reset button
- Key Matrix
- 3.5mm connector
- RGB Matrix
- RGB Matrix
